# EasyEDA schematic 01.json
TITLE: Sheet_1; REV: 1.0; Date: 2024-04-06; Sheet: 1/1; Drawn By: romansuk05; Company: Your Company
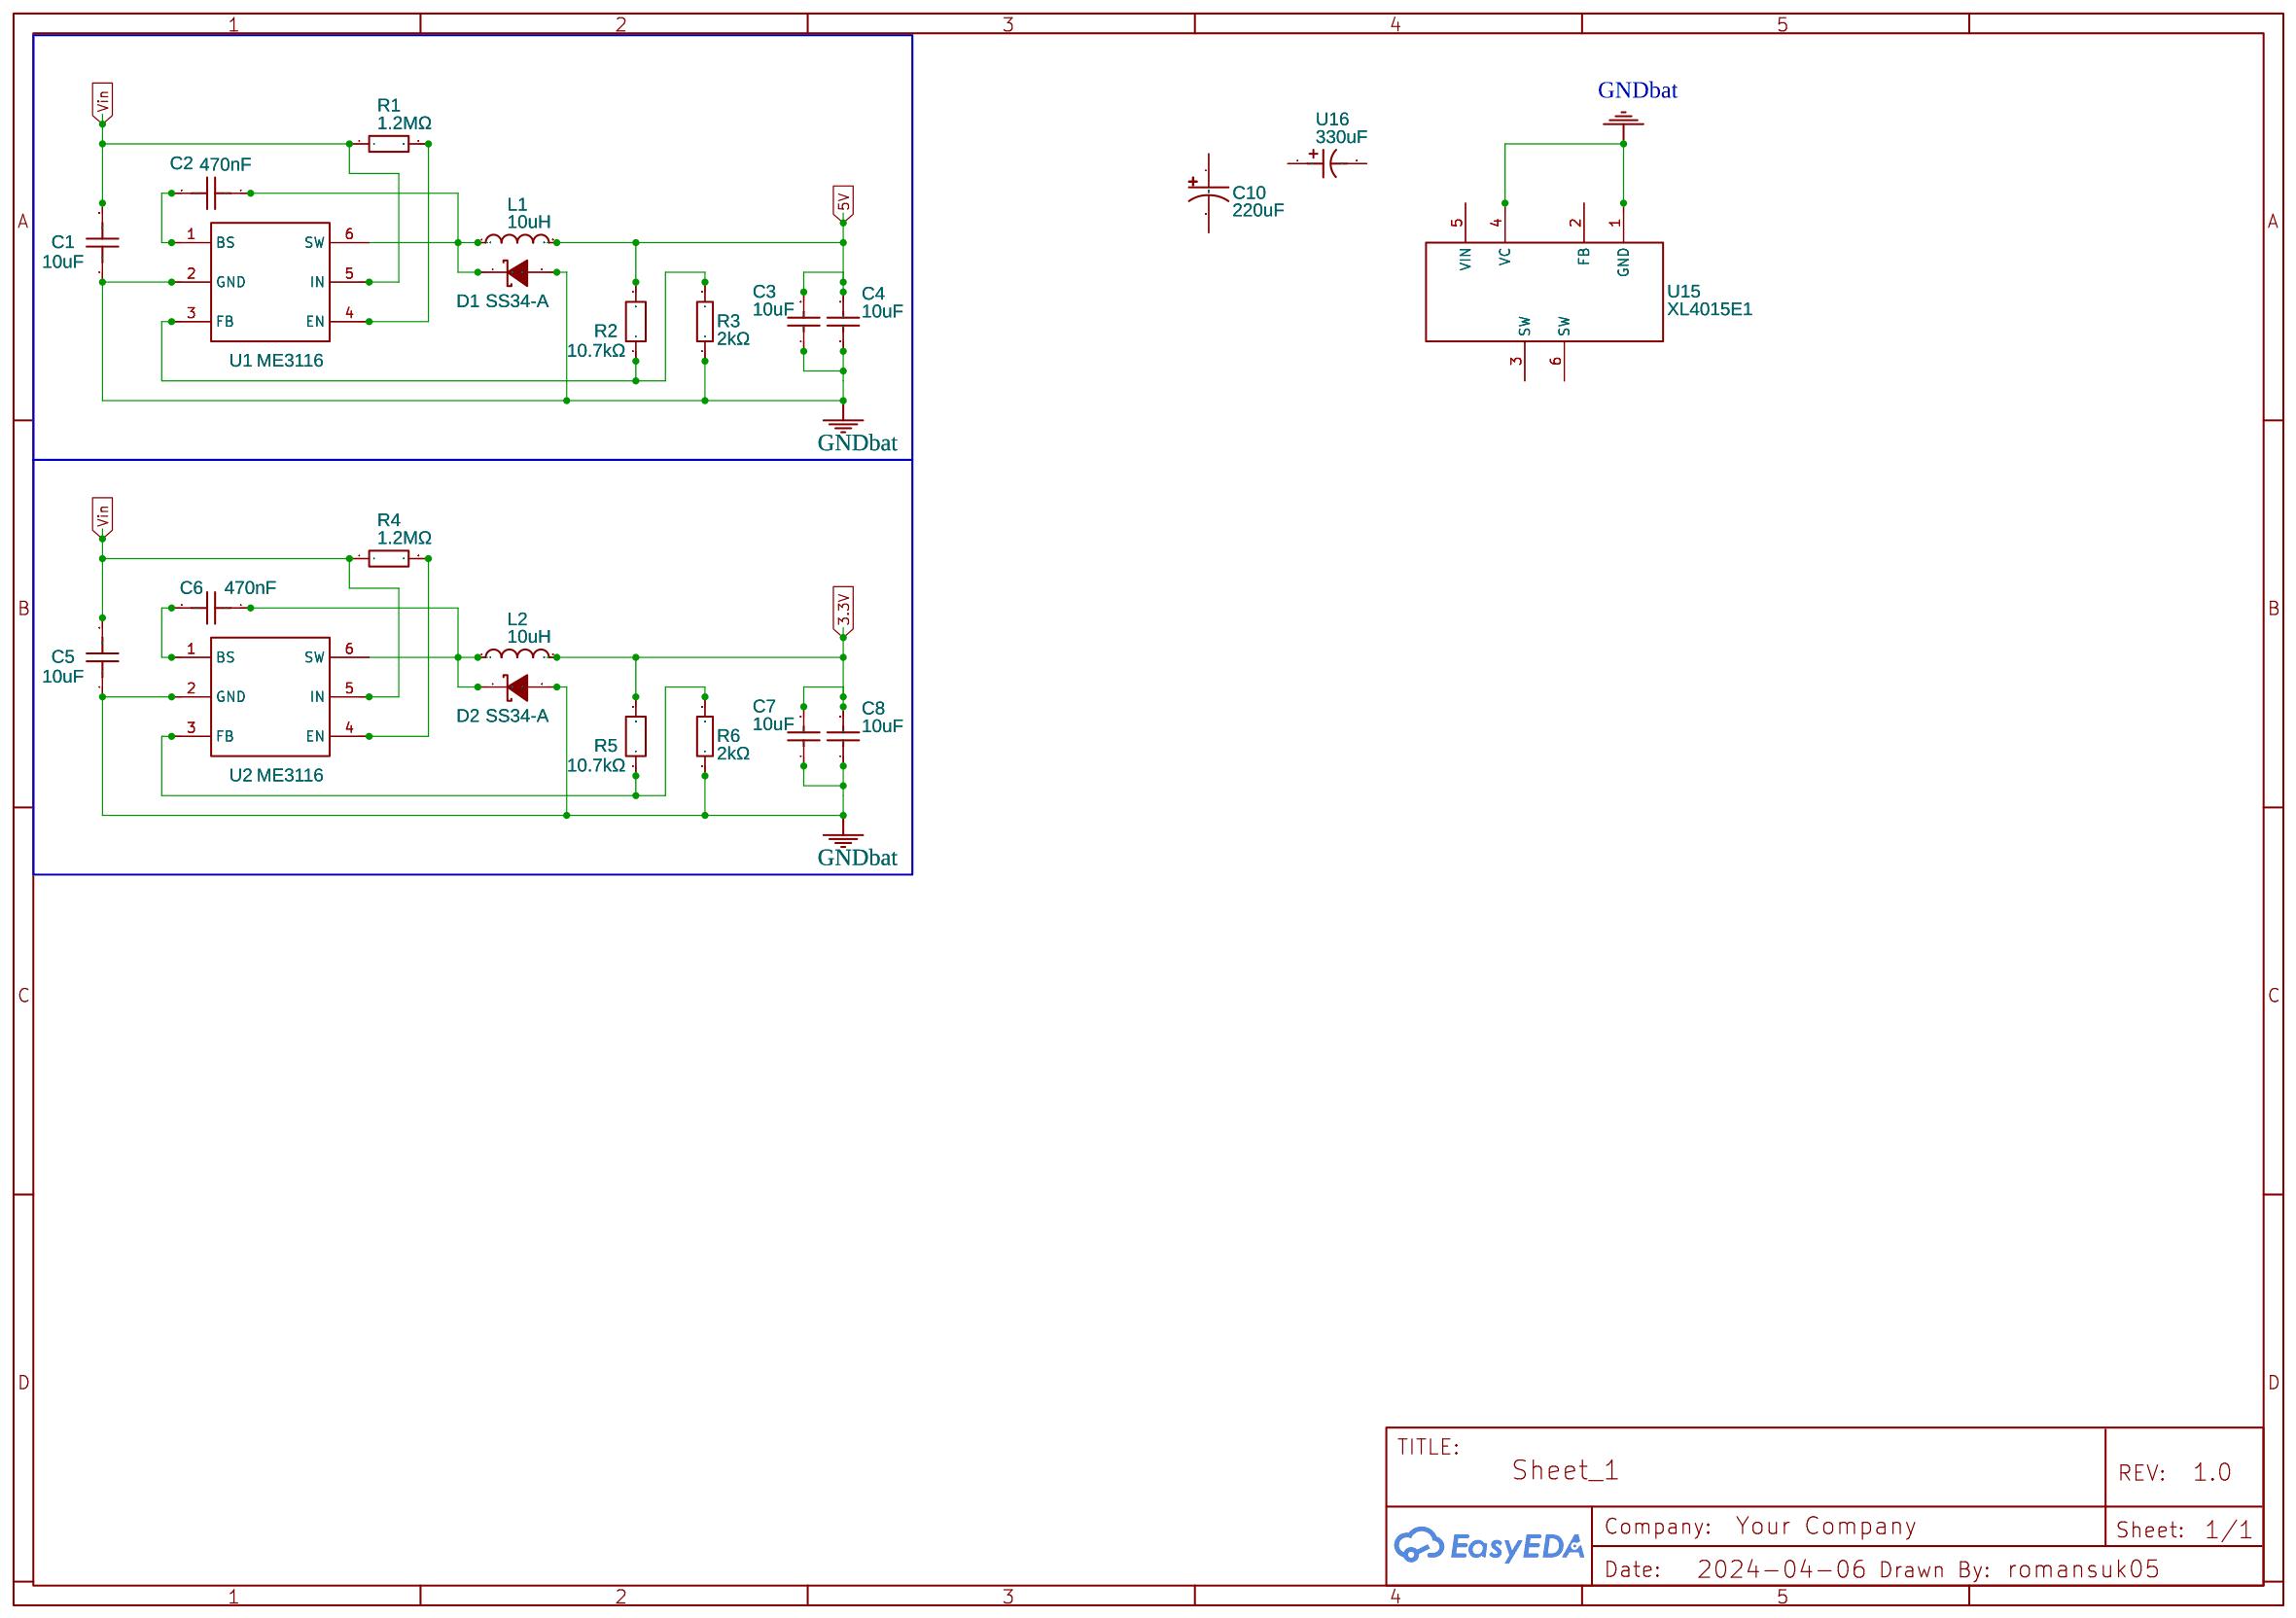
[diagram p0: schematic sheet]

## Parts
C1  10uF  [C1206]
C2  470nF  [C1206]
C3  10uF  [C1206]
C4  10uF  [C1206]
C5  10uF  [C1206]
C6  470nF  [C1206]
C7  10uF  [C1206]
C8  10uF  [C1206]
C10  220uF  [CAP-SMD_BD10.0-L10.3-W10.3-FD-LS11.0]
D1  SS34-A  [SMA_L4.3-W2.6-LS5.2-RD]
D2  SS34-A  [SMA_L4.3-W2.6-LS5.2-RD]
L1  10uH  [IND-SMD_L7.8-W7.0_APC07A50]
L2  10uH  [IND-SMD_L7.8-W7.0_APC07A50]
R1  1.2MΩ  [R1206]
R2  10.7kΩ  [R1206]
R3  2kΩ  [R1206]
R4  1.2MΩ  [R1206]
R5  10.7kΩ  [R1206]
R6  2kΩ  [R1206]
U1  ME3116  [SOT-23-6_L2.9-W1.6-P0.95-LS2.8-BL]
U2  ME3116  [SOT-23-6_L2.9-W1.6-P0.95-LS2.8-BL]
U15  XL4015E1  [TO-263-5_L10.2-W8.9-P1.70-TL]
U16  330uF  [CAP-SMD_BD6.3-L6.6-W6.6-LS7.6-RD]

## Library data of the parts
C1 C5 = TCC1206X7R106K250HT: Contributor: LCSC; Supplier: LCSC; Supplier Part: C380364; Manufacturer: CCTC(三环); JLCPCB Part Class: Extended Part
C2 C6 = TCC1206X7R474K500FT: Contributor: LCSC; Supplier: LCSC; Supplier Part: C282872; Manufacturer: CCTC(三环); JLCPCB Part Class: Extended Part
C3 C4 C7 C8 = TMK316B7106KL-TD: Supplier: LCSC; Manufacturer: TAIYO YUDEN(太诱); Supplier Part: C92831; JLCPCB Part Class: Extended Part
C10 = BXJ-50V220-10*10: Contributor: LCSC; Supplier: LCSC; Supplier Part: C165634; Manufacturer: SAMYOUNG(韩国三莹); Manufacturer Part: BXJ50V220M10*10 10TP; JLCPCB Part Class: Extended Part
D1 D2 = SS34-A: Contributor: LCSC; Supplier: LCSC; Supplier Part: C143201; Manufacturer: FMS(美丽微); JLCPCB Part Class: Extended Part
L1 L2 = CY75SX-10UH: Contributor: LCSC; Supplier: LCSC; Supplier Part: C2879701; Manufacturer: SHOU HAN(首韩); JLCPCB Part Class: Extended Part
R1 R4 = WR12W1204FTL: Contributor: LCSC; Supplier: LCSC; Manufacturer: Walsin(华新科); Supplier Part: C171052; JLCPCB Part Class: Extended Part
R2 R5 = RC1206FR-0710K7L: Contributor: LCSC; Supplier: LCSC; Supplier Part: C488612; Manufacturer: YAGEO(国巨); JLCPCB Part Class: Extended Part
R3 R6 = RTT06202JTP: Supplier: LCSC; Manufacturer: RALEC(旺诠); Supplier Part: C104689; JLCPCB Part Class: Extended Part
U1 U2 = ME3116: Supplier: LCSC; Manufacturer: MICRONE(南京微盟); Manufacturer Part: ME3116AM6G; Supplier Part: C97643; JLCPCB Part Class: Extended Part
U15 = XL4015E1: Supplier: LCSC; Manufacturer: XLSEMI(芯龙); Supplier Part: C51661; JLCPCB Part Class: Extended Part
U16 = 189RV0016: Supplier: LCSC; Supplier Part: C7471878; Manufacturer: KNSCHA(科尼盛); Contributor: lcsc; JLCPCB Part Class: Extended Part

## Nets
3.3V: C7.2 C8.2 L2.2 R5.2
5V: C3.2 C4.2 L1.2 R2.2
GNDbat: C1.1 C3.1 C4.1 C5.1 C7.1 C8.1 D1.2(A) D2.2(A) R3.1 R6.1 U1.2(GND) U2.2(GND) U15.1(GND) U15.4(VC)
Vin: C1.2 C5.2 R1.1 R4.1 U1.5(IN) U2.5(IN)
Net-(C2-1): C2.1 D1.1(C) L1.1 U1.6(SW)
Net-(C2-2): C2.2 U1.1(BS)
Net-(C6-1): C6.1 D2.1(C) L2.1 U2.6(SW)
Net-(C6-2): C6.2 U2.1(BS)
Net-(R1-2): R1.2 U1.4(EN)
Net-(R2-1): R2.1 R3.2 U1.3(FB)
Net-(R4-2): R4.2 U2.4(EN)
Net-(R5-1): R5.1 R6.2 U2.3(FB)

Not connected (* = marked no-connect by the designer): C10 1 2; U15 2(FB) 3(SW) 5(VIN) 6(SW); U16 1 2
